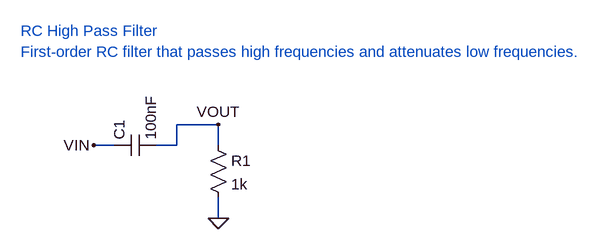
[diagram p0: schematic rc_high_pass_filter.asc]
rc_high_pass_filter.asc, the LTspice schematic file:
Version 4
SHEET 1 1200 800
TEXT 16 16 Left 2 ;RC High Pass Filter
TEXT 16 48 Left 2 ;First-order RC filter that passes high frequencies and attenuates low frequencies.
SYMBOL cap 160 208 R270
SYMATTR InstName C1
SYMATTR Value 100nF
SYMBOL res 304 176 R0
SYMATTR InstName R1
SYMATTR Value 1k
FLAG 128 192 VIN
WIRE 128 192 160 192
FLAG 320 160 VOUT
WIRE 224 192 256 192
WIRE 256 160 256 192
WIRE 256 160 320 160
WIRE 320 160 320 192
FLAG 320 304 0
WIRE 320 272 320 304

The netlist it stands for:
* rc_high_pass_filter.asc
C1 VIN VOUT 100nF
R1 VOUT 0 1k
* RC High Pass Filter
* First-order RC filter that passes high frequencies and attenuates low frequencies.
.backanno
.end